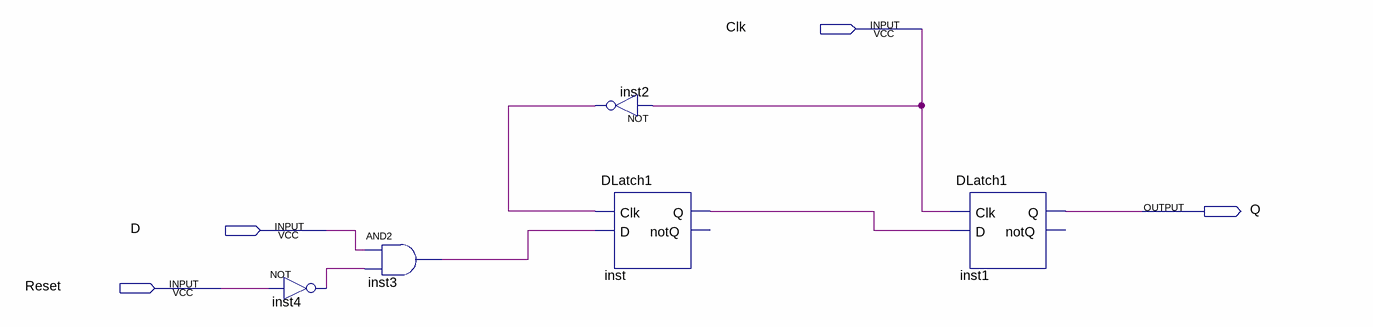
[diagram p0: schematic sheet]
// Quartus schematic D_Latch_Fl.bdf as structural Verilog: 5 symbols, 4 pins
module D_Latch_Fl (
  input  Clk,
  input  D,
  input  Reset,
  output Q
);

  wire inst2_out, inst3_out, inst4_out, inst_q;

  not inst4 (inst4_out, Reset);
  and inst3 (inst3_out, D, inst4_out);
  not inst2 (inst2_out, Clk);
  DLatch1 inst (.Clk(inst2_out), .D(inst3_out), .Q(inst_q));  // open: notQ
  DLatch1 inst1 (.Clk(Clk), .D(inst_q), .Q(Q));  // open: notQ
endmodule
